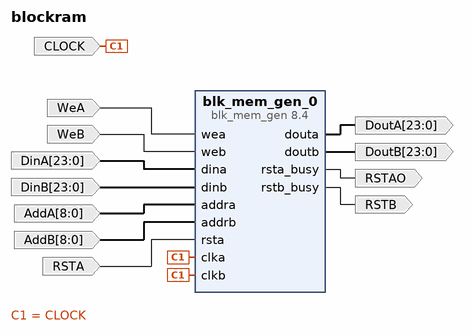
[diagram p0: block diagram of the top level]
# Vivado block design blockram, xc7a100tcsg324-1, Vivado 2017.4
create_bd_design blockram

create_bd_port -dir I -type clk CLOCK
set_property -dict {CONFIG.FREQ_HZ 100000000} [get_bd_ports CLOCK]
create_bd_port -dir I WeA
create_bd_port -dir I WeB
create_bd_port -dir I -from 23 -to 0 -type data DinA
create_bd_port -dir I -from 23 -to 0 -type data DinB
create_bd_port -dir O -from 23 -to 0 -type data DoutA
create_bd_port -dir O -from 23 -to 0 -type data DoutB
create_bd_port -dir I -from 8 -to 0 -type data AddA
create_bd_port -dir I -from 8 -to 0 -type data AddB
create_bd_port -dir I RSTA
create_bd_port -dir O RSTB
create_bd_port -dir O RSTAO

create_bd_cell -type ip -vlnv xilinx.com:ip:blk_mem_gen:8.4 blk_mem_gen_0
set_property -dict [list \
  CONFIG.Memory_Type True_Dual_Port_RAM \
  CONFIG.Enable_32bit_Address false \
  CONFIG.Use_Byte_Write_Enable false \
  CONFIG.Write_Width_A 24 \
  CONFIG.Write_Depth_A 512 \
  CONFIG.Read_Width_A 24 \
  CONFIG.Operating_Mode_A WRITE_FIRST \
  CONFIG.Enable_A Always_Enabled \
  CONFIG.Write_Width_B 24 \
  CONFIG.Read_Width_B 24 \
  CONFIG.Enable_B Always_Enabled \
  CONFIG.Register_PortA_Output_of_Memory_Primitives true \
  CONFIG.Register_PortB_Output_of_Memory_Primitives true \
  CONFIG.Use_RSTA_Pin true \
  CONFIG.Reset_Memory_Latch_A false \
  CONFIG.Port_B_Clock 100 \
  CONFIG.Port_B_Write_Rate 50 \
  CONFIG.Port_B_Enable_Rate 100 \
  CONFIG.use_bram_block Stand_Alone \
  CONFIG.EN_SAFETY_CKT true \
] [get_bd_cells blk_mem_gen_0]

# ---- connections ----

connect_bd_net [get_bd_ports CLOCK] [get_bd_pins blk_mem_gen_0/clka] [get_bd_pins blk_mem_gen_0/clkb]
connect_bd_net [get_bd_ports WeA] [get_bd_pins blk_mem_gen_0/wea]
connect_bd_net [get_bd_ports WeB] [get_bd_pins blk_mem_gen_0/web]
connect_bd_net [get_bd_ports DinA] [get_bd_pins blk_mem_gen_0/dina]
connect_bd_net [get_bd_ports DinB] [get_bd_pins blk_mem_gen_0/dinb]
connect_bd_net [get_bd_pins blk_mem_gen_0/douta] [get_bd_ports DoutA]
connect_bd_net [get_bd_pins blk_mem_gen_0/doutb] [get_bd_ports DoutB]
connect_bd_net [get_bd_ports AddA] [get_bd_pins blk_mem_gen_0/addra]
connect_bd_net [get_bd_ports AddB] [get_bd_pins blk_mem_gen_0/addrb]
connect_bd_net [get_bd_ports RSTA] [get_bd_pins blk_mem_gen_0/rsta]
connect_bd_net [get_bd_pins blk_mem_gen_0/rstb_busy] [get_bd_ports RSTB]
connect_bd_net [get_bd_pins blk_mem_gen_0/rsta_busy] [get_bd_ports RSTAO]

validate_bd_design
save_bd_design
